# Altium schematic sheet Power.SchDoc
size A4; SheetNumber: 2; SheetTotal: 8
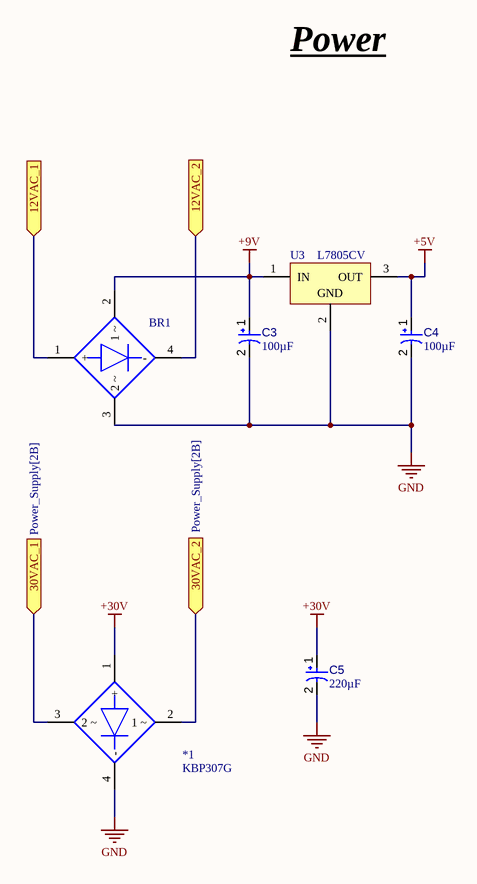
[diagram p0: Power.SchDoc]

## Parts
*1  KBP307G  [KBP4]
BR1  GBU8D  [FP-127EL-MFG]  (value not drawn)
C3  value 100µF  [CAPPR55-250-1120X630X1220]  (hidden comment: ECA-2AM220)
C4  value 100µF  [CAPPR55-250-1120X630X1220]  (hidden comment: ECA-2AM220)
C5  value 220µF  [CAPPR65-500-1250X1000X1350]  (hidden comment: ECA-1HM221)
U3  L7805CV  [TO220]

## Ports
12VAC_1 (in), 12VAC_2 (in), 30VAC_1 (in, see Power_Supply[2B]), 30VAC_2 (in, see Power_Supply[2B])

## Nets
+5V: C4.1 U3.3(OUT)
+9V: BR1.2(1_~) C3.1 U3.1(IN)
+30V: *1.1(+) C5.1
GND: *1.4(-) BR1.3(2_~) C3.2 C4.2 C5.2 U3.2(GND)
12VAC_1: BR1.1(+) ; port 12VAC_1
12VAC_2: BR1.4(-) ; port 12VAC_2
30VAC_1: *1.3(2_~) ; port 30VAC_1
30VAC_2: *1.2(1_~) ; port 30VAC_2

## Notes on the sheet
- Power

## Library data of the parts
*1 = CMP-019-00050-1: 3A, 1000V, Standard Bridge Rectifier; Max Operating Temperature: 150°C; Mounting Technology: Through Hole; Pins: 4; Min Operating Temperature: -55°C
BR1 = CMP-00278-84328822-1: GBU8D Diode Rectifier Bridge Single 200V 8A 4-Pin Case GBU Rail; Manufacturer Lifecycle Status: ACTIVE; Peak Reverse Current: 5µA; Max Forward Surge Current (Ifsm): 200A; Max Reverse Leakage Current: 50µA; Forward Voltage: 1V; Max Junction Temperature (Tj): 150°C; Number of Elements: 1; Power Dissipation: 16W; Element Configuration: Single; Radiation Hardening: No; Lifecycle Status: Production; Min Operating Temperature: -55°C; Height: 18.8mm; NexarPartId: 84328822; Mount: Through Hole; Width: 3.56mm; RoHS: Compliant; Average Rectified Current: 8A; Length: 22.3mm; Lead Free: Lead Free; Forward Current: 8A; Output Current: 8A; Max Operating Temperature: 150°C; Number of Pins: 4; Max Repetitive Reverse Voltage (Vrrm): 200V; Voltage Rating (DC): 200V; Weight: 5.4g; Contact Plating: Tin; Max Surge Current: 200A; Schedule B: 8541100080; Current Rating: 8A; REACH SVHC: No SVHC; Case/Package: SIP; Peak Non-Repetitive Surge Current: 200A; Reverse Voltage: 200V
C3 C4 = CMP-001-00035-7: Aluminum Electrolytic Capacitor, 22 uF, +/- 20%, 100 V, -40 to 85 degC, 2-Pin THD, RoHS, Bulk; Manufacturer: Panasonic; Voltage Rating: 100V; Ripple Current: 115mA; Manufacturer URL: http://www.panasonic.com/; Packaging: Bulk; Package Description: 2-Pin Radial Lead, Dia 6.3 mm, Height 12.2 mm; Datasheet URL: https://industrial.panasonic.com/cdbs/www-data/pdf/RDF0000/ABA0000C1047.pdf; RoHS Compliant: True; Package Quantity: 200; Case/Package: Radial; Package Reference: CAPPR55-250-1120X630X1220; Datasheet Version: Mar-16; Pins: 2; Tolerance: 20%; Diameter: 6.3mm; Max Operating Temperature: 85°C; Ripple Current (AC): 115mA; Capacitor Type: Electrolytic; Mounting Technology: TH; Min Operating Temperature: -40°C; Lead Pitch: 2.5mm
C5 = CMP-001-00028-7: Aluminum Electrolytic Capacitor, 220 uF, +/- 20%, 50 V, -40 to 85 degC, 2-Pin THD, RoHS, Bulk; Manufacturer: Panasonic; Ripple Current (AC): 400mA; Voltage Rating: 50V; Case/Package: Radial; Packaging: Bulk; Package Quantity: 200; Min Operating Temperature: -40°C; Datasheet Version: Mar-16; Package Reference: CAPPR65-500-1250X1000X1350; Mounting Technology: TH; Ripple Current: 400mA; Pins: 2; Package Description: 2-Pin Radial Lead, Dia 10 mm, Body Length 12.5 mm; RoHS Compliant: True; Max Operating Temperature: 85°C; Lead Pitch: 5mm; Tolerance: 20%; Manufacturer URL: http://www.panasonic.com/; Diameter: 10mm; Capacitor Type: Electrolytic; Datasheet URL: http://industrial.panasonic.com/cdbs/www-data/pdf/RDF0000/DMF0000COL68.pdf
U3 = CMP-0244-00483-1: Positive Voltage Regulator, 5V, 3-Pin TO-220; PackageDescription: TO, Thru-Hole, Vertical, Heatsink Mounted; 3 In-Line Leads; Pitch 2.54 mm; ComponentLink2Description: Datasheet; PackageReference: TO220; ComponentLink3URL: http://www.st.com/internet/com/TECHNICAL_RESOURCES/TECHNICAL_LITERATURE/PACKAGE_INFORMATION/CD00004649.pdf; DatasheetVersion: 16/11/2011; ComponentLink1Description: Manufacturer URL; ComponentLink1URL: http://www.st.com; PackageVersion: ver3.0; ComponentLink3Description: Package Specification; ComponentLink2URL: http://www.st.com/internet/com/TECHNICAL_RESOURCES/TECHNICAL_LITERATURE/DATASHEET/CD00000444.pdf